# EAGLE schematic Environment-ArduinoNano44-Mini-Enclosure-V10 (EAGLE 7.4.0)
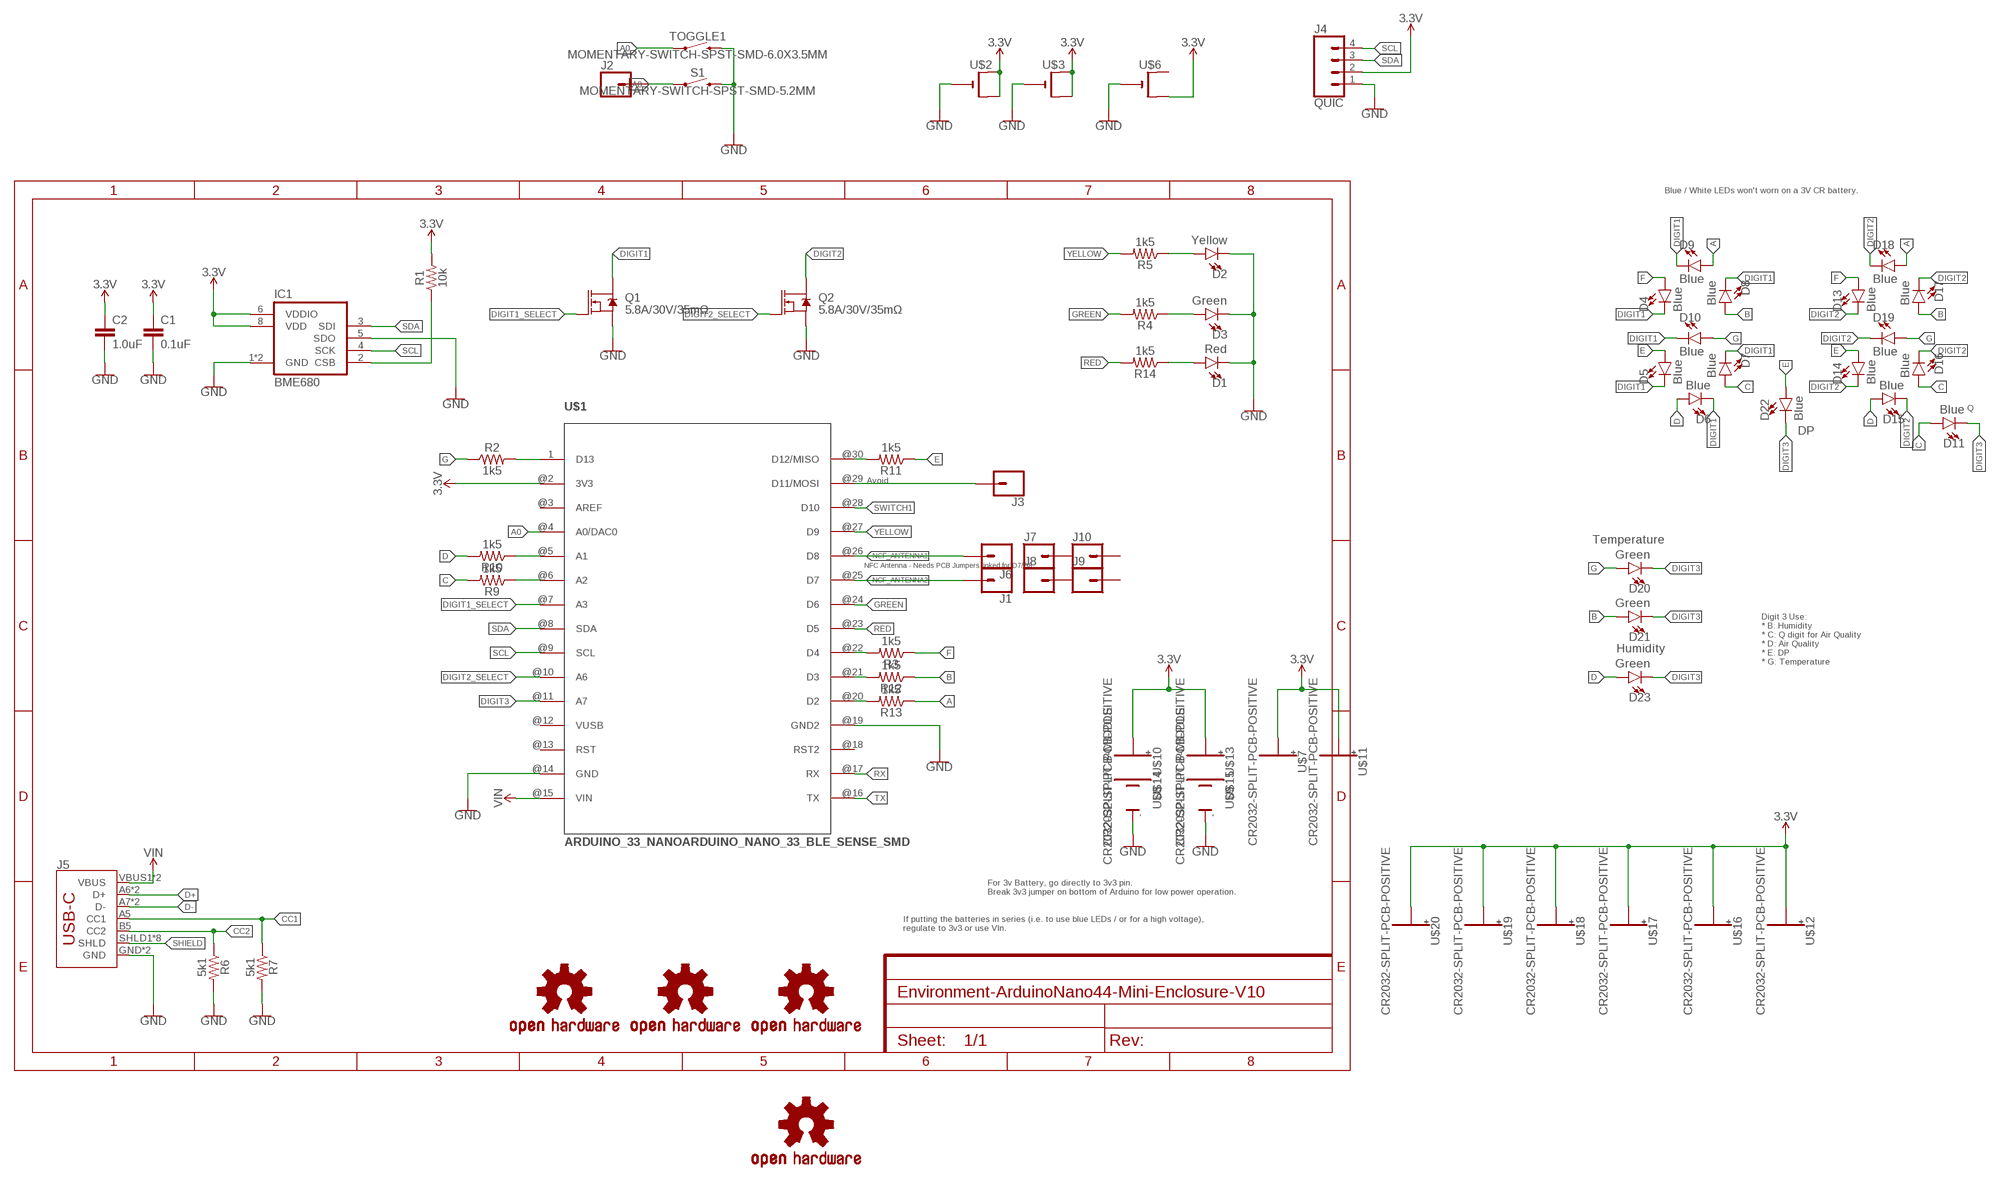
[diagram p0: schematic, sheet 1]

## Parts
C1  0.1uF  0.1UF-0805-25V  [0805]
C2  1.0uF  1.0UF-0805-25V-10%  [0805]
D1  Red  LED1206  [LED-1206]
D2  Yellow  LED1206  [LED-1206]
D3  Green  LED1206  [LED-1206]
D4  Blue  LED1206  [LED-1206]
D5  Blue  LED1206  [LED-1206]
D6  Blue  LED1206  [LED-1206]
D7  Blue  LED1206  [LED-1206]
D8  Blue  LED1206  [LED-1206]
D9  Blue  LED1206  [LED-1206]
D10  Blue  LED1206  [LED-1206]
D11  Blue  LED1206  [LED-1206]
D13  Blue  LED1206  [LED-1206]
D14  Blue  LED1206  [LED-1206]
D15  Blue  LED1206  [LED-1206]
D16  Blue  LED1206  [LED-1206]
D17  Blue  LED1206  [LED-1206]
D18  Blue  LED1206  [LED-1206]
D19  Blue  LED1206  [LED-1206]
D20  Green  LED1206  [LED-1206]
D21  Green  LED1206  [LED-1206]
D22  Blue  LED1206  [LED-1206]
D23  Green  LED1206  [LED-1206]
IC1  BME680  [BME680]
J1  CONN_01  [1X01]
J2  CONN_01  [1X01]
J3  CONN_01  [1X01]
J4  QUIC  CONN_04SMD2  [JST04_1MM_RA]
J5  USB_C2-LAYER  [USB-C-16P]
J6  CONN_01  [1X01]
J7  CONN_01  [1X01]
J8  CONN_01  [1X01]
J9  CONN_01  [1X01]
J10  CONN_01  [1X01]
LOGO1  OSHW-LOGOM  [OSHW-LOGO-M]
LOGO2  OSHW-LOGOL  [OSHW-LOGO-L]
LOGO3  OSHW-LOGOL  [OSHW-LOGO-L]
LOGO7  OSHW-LOGOM  [OSHW-LOGO-M]
Q1  5.8A/30V/35mΩ  MOSFET-NCH-AO3404A  [SOT23-3]
Q2  5.8A/30V/35mΩ  MOSFET-NCH-AO3404A  [SOT23-3]
R1  10k  RESISTOR0805  [0805]
R2  1k5  RESISTOR0805  [0805]
R3  1k5  RESISTOR0805  [0805]
R4  1k5  RESISTOR0805  [0805]
R5  1k5  RESISTOR0805  [0805]
R6  5k1  RESISTOR0805  [0805]
R7  5k1  RESISTOR0805  [0805]
R9  1k5  RESISTOR0805  [0805]
R10  1k5  RESISTOR0805  [0805]
R11  1k5  RESISTOR0805  [0805]
R12  1k5  RESISTOR0805  [0805]
R13  1k5  RESISTOR0805  [0805]
R14  1k5  RESISTOR0805  [0805]
S1  MOMENTARY-SWITCH-SPST-SMD-5.2MM  [TACTILE_SWITCH_SMD_5.2MM]
TOGGLE1  MOMENTARY-SWITCH-SPST-SMD-6.0X3.5MM  [TACTILE_SWITCH_SMD_6.0X3.5MM]
U$1  ARDUINO_33_NANOARDUINO_NANO_33_BLE_SENSE_SMD  [ARDUINO_NANO_33_SMD]
U$2  CR2032SMT  [CR2032-SMD]
U$3  CR2032SMT  [CR2032-SMD]
U$6  CR2032SMT  [CR2032-SMD]
U$7  CR2032-SPLIT-PCB-POSITIVE  [CR2032-SMD-POSITIVE-TERMINAL]
U$8  CR2032-SPLIT-PCBCR2032-NEGATIVE  [CR2032-SMD-NEGATIVE-TERMINAL]
U$9  CR2032-SPLIT-PCBCR2032-NEGATIVE  [CR2032-SMD-NEGATIVE-TERMINAL]
U$10  CR2032-SPLIT-PCB-POSITIVE  [CR2032-SMD-POSITIVE-TERMINAL]
U$11  CR2032-SPLIT-PCB-POSITIVE  [CR2032-SMD-POSITIVE-TERMINAL]
U$12  CR2032-SPLIT-PCB-POSITIVE  [CR2032-SMD-POSITIVE-TERMINAL]
U$13  CR2032-SPLIT-PCB-POSITIVE  [CR2032-SMD-POSITIVE-TERMINAL]
U$14  CR2032-SPLIT-PCB-MIDDLE  [CR2032-SMD-MIDDLE-OUTLINE]
U$15  CR2032-SPLIT-PCB-MIDDLE  [CR2032-SMD-MIDDLE-OUTLINE]
U$16  CR2032-SPLIT-PCB-POSITIVE  [CR2032-SMD-POSITIVE-TERMINAL]
U$17  CR2032-SPLIT-PCB-POSITIVE  [CR2032-SMD-POSITIVE-TERMINAL]
U$18  CR2032-SPLIT-PCB-POSITIVE  [CR2032-SMD-POSITIVE-TERMINAL]
U$19  CR2032-SPLIT-PCB-POSITIVE  [CR2032-SMD-POSITIVE-TERMINAL]
U$20  CR2032-SPLIT-PCB-POSITIVE  [CR2032-SMD-POSITIVE-TERMINAL]

## Nets
3.3V: C1.1 C2.1 IC1.6(VDDIO) IC1.8(VDD) J4.2 R1.2 U$1.@2(3V3) U$2.+$1(+) U$2.+$2(+1) U$3.+$1(+) U$3.+$2(+1) U$6.+$2(+1) U$7.+ U$10.+ U$11.+ U$12.+ U$13.+ U$16.+ U$17.+ U$18.+ U$19.+ U$20.+
A: D9.A D18.A R13.1
A0: J2.1 S1.1 TOGGLE1.1 U$1.@4(A0/DAC0)
B: D8.A D17.A D21.A R12.1
C: D7.A D11.A D16.A R9.2
CC1: J5.A5(CC1) R7.1
CC2: J5.B5(CC2) R6.1
D: D6.A D15.A D23.A R10.2
D+: J5.A6(D+) J5.B6(D+)
D-: J5.A7(D-) J5.B7(D-)
DIGIT1: D4.C D5.C D6.C D7.C D8.C D9.C D10.C Q1.3(D)
DIGIT1_SELECT: Q1.1(G) U$1.@7(A3)
DIGIT2: D13.C D14.C D15.C D16.C D17.C D18.C D19.C Q2.3(D)
DIGIT2_SELECT: Q2.1(G) U$1.@10(A6)
DIGIT3: D11.C D20.C D21.C D22.C D23.C U$1.@11(A7)
E: D5.A D14.A D22.A R11.1
F: D4.A D13.A R3.1
G: D10.A D19.A D20.A R2.1
GND: C1.2 C2.2 D1.C D2.C D3.C IC1.1(GND) IC1.5(SDO) IC1.7(GND) J4.1 J5.GND J5.GND2(GND) Q1.2(S) Q2.2(S) R6.2 R7.2 S1.3 TOGGLE1.2 U$1.@14(GND) U$1.@19(GND2) U$2.- U$3.- U$6.- U$8.- U$9.-
GREEN: R4.2 U$1.@24(D6)
N$2: IC1.2(CSB) R1.1
N$4: D1.A R14.1
N$7: R9.1 U$1.@6(A2)
N$8: R2.2 U$1.1(D13)
N$9: R11.2 U$1.@30(D12/MISO)
N$10: R12.2 U$1.@21(D3)
N$11: R10.1 U$1.@5(A1)
N$12: R13.2 U$1.@20(D2)
N$13: R3.2 U$1.@22(D4)
N$14: D3.A R4.1
N$16: D2.A R5.1
N$43: J3.1 U$1.@29(D11/MOSI)
NCF_ANTENNA1: J6.1 U$1.@26(D8)
NCF_ANTENNA2: J1.1 U$1.@25(D7)
RED: R14.2 U$1.@23(D5)
RX: U$1.@17(RX)
SCL: IC1.4(SCK) J4.4 U$1.@9(SCL)
SDA: IC1.3(SDI) J4.3 U$1.@8(SDA)
SHIELD: J5.SHLD1(SHLD) J5.SHLD2(SHLD) J5.SHLD3(SHLD) J5.SHLD4(SHLD) J5.SHLD5(SHLD) J5.SHLD6(SHLD) J5.SHLD7(SHLD) J5.SHLD8(SHLD)
SWITCH1: U$1.@28(D10)
TX: U$1.@16(TX)
VIN: J5.VBUS1(VBUS) J5.VBUS2(VBUS) U$1.@15(VIN)
YELLOW: R5.2 U$1.@27(D9)
Unconnected: J7.1 J8.1 J9.1 J10.1 U$1.@3(AREF) U$1.@13(RST) U$1.@18(RST2) U$6.+$1(+)

## Notes on the sheet
- Blue / White LEDs won't worn on a 3V CR battery.
- Q
- DP
- Avoid
- Temperature
- NFC Antenna - Needs PCB Jumpers linked for D7/D8
- Humidity
- Digit 3 Use:
  * B: Humidity
  * C: Q digit for Air Quality
  * D: Air Quality
  * E: DP
  * G: Temperature
- For 3v Battery, go directly to 3v3 pin.
  Break 3v3 jumper on bottom of Arduino for low power operation.
- If putting the batteries in series (i.e. to use blue LEDs / or for a high voltage), 
  regulate to 3v3 or use VIn.

## Power pins joined to a net without a drawn wire
VUSB: U$1.@12(VUSB)

## Library data of the parts
C1 = ThingySticks:0.1UF: 0.1µF ceramic capacitors A capacitor is a passive two-terminal electrical component used to store electrical energy temporarily in an electric field.
C2 = ThingySticks:1.0UF: 1µF ceramic capacitors A capacitor is a passive two-terminal electrical component used to store electrical energy temporarily in an electric field.
D1-D11 D13-D23 = ThingySticks:LED: LED (Generic) Standard schematic elements and footprints for 5mm, 3mm, 1206, and 0603 sized LEDs. Generic LEDs with no color specified.
IC1 = ThingySticks:BME680: BME680 integrates for the first time individual high linearity and high accuracy sensors for gas, pressure, humidity and temperature. The library has been designed by Richard Magdycz <https://www.facebook.com/groups/eaglecadsoftUK> Original version had pins in incorrect places (BME680 uses untypical clockwise direction). Updated 17 Feb 2018 S.Harrison ThingySticks.com
J1-J3 J6-J10 = SparkFun-Connectors:CONN_01: Single connection point. Often used as Generic Header-pin footprint for 0.1 inch spaced/style header connections On any of the 0.1 inch spaced packages, you can populate with these: Break Away Headers - Straight <https://www.sparkfun.com/products/116> (PRT-00116) Break Away Male Headers - Right Angle <https://www.sparkfun.com/products/553> (PRT-00553) Female Headers <https://www.sparkfun.com/products/115> (PRT-00115) Break Away Headers - Machine Pin <https://www.sparkfun.com/products/117> (PRT-00117) Break Away Female Headers - Swiss Machine Pin <https://www.sparkfun.com/products/743> (PRT-00743) This device is also useful as a general connection point to wire up your design to another part of your project. Our various solder wires solder well into these plated through hole pads. Hook-Up Wire - Assortment (Stranded, 22 AWG) <https://www.sparkfun.com/products/11375> (PRT-11375) Hook-Up Wire - Assortment (Solid Core, 22 AWG) <https://www.sparkfun.com/products/11367> (PRT-11367) View the entire wire category on our website here <https://www.sparkfun.com/categories/141> Special notes: SMTSO-256-ET is a "flush mount" nut for a 4-40 screw. We mostly use this on specialty testbeds; it is a nice way to connect hardware to your PCB at an adjustable hieght. Also note, the SNAP packages are for using a snappable style connector. We sell a baggie of snaps and they are also used on two LilyPad designs: Snap Assortment - 30 pack (male and female) <https://www.sparkfun.com/products/11347> (DEV-11347) LilyPad Arduino SimpleSnap <https://www.sparkfun.com/products/10941> (DEV-10941) LilyPad SimpleSnap Protoboard <https://www.sparkfun.com/products/10940> (DEV-10940)
J4 = SparkFun-Connectors-2020-01-17:CONN_04: Multi connection point. Often used as Generic Header-pin footprint for 0.1 inch spaced/style header connections On any of the 0.1 inch spaced packages, you can populate with these: Break Away Headers - Straight <https://www.sparkfun.com/products/116> (PRT-00116) Break Away Male Headers - Right Angle <https://www.sparkfun.com/products/553> (PRT-00553) Female Headers <https://www.sparkfun.com/products/115> (PRT-00115) Break Away Headers - Machine Pin <https://www.sparkfun.com/products/117> (PRT-00117) Break Away Female Headers - Swiss Machine Pin <https://www.sparkfun.com/products/743> (PRT-00743) For SCREWTERMINALS and SPRING TERMINALS visit here: Screw Terimnals on SparkFun.com <https://www.sparkfun.com/search/results?term=Screw+Terminals> (5mm/3.5mm/2.54mm spacing) This device is also useful as a general connection point to wire up your design to another part of your project. Our various solder wires solder well into these plated through hole pads. Hook-Up Wire - Assortment (Stranded, 22 AWG) <https://www.sparkfun.com/products/11375> (PRT-11375) Hook-Up Wire - Assortment (Solid Core, 22 AWG) <https://www.sparkfun.com/products/11367> (PRT-11367) View the entire wire category on our website here <https://www.sparkfun.com/categories/141> Special notes: Molex polarized connector foot print use with SKU : PRT-08231 with associated crimp pins and housings. 1MM SMD Version SKU: PRT-10208; PROD_ID: CONN-10310; SF_ID: PRT-10208
J5 = SparkFun-Connectors-2020-01-17:USB_C: USB Type C 16Pin Connector Super Speed pins not available on the 16-pin purely SMD connector so this part is best for USB 2.0 implementations. D1 and D2 are tied together enabling D+/- no matter which way the cable is plugged into the connector. The two channel configuration pins (CC1/2) are exposed. These are normally connected to ground via 5.1k resistors but can be reconfigured for high current/high power applications.; PROD_ID: CONN-14122
LOGO1-LOGO3 LOGO7 = SparkFun-Aesthetics:OSHW-LOGO: Open-Source Hardware (OSHW) Logo This logo indicates the piece of hardware it is found on incorporates a OSHW license and/or adheres to the definition of open source hardware found here: http://freedomdefined.org/OSHW
Q1 Q2 = SparkFun-DiscreteSemi:MOSFET-NCH: N-channel MOSFETs Voltage controlled devices that allow control of high current outputs. SparkFun Products: SparkFun OpenScale <https://www.sparkfun.com/products/13261> SparkFun Digital Sandbox <https://www.sparkfun.com/products/12651> SparkFun Monster Moto Shield <https://www.sparkfun.com/products/10182> SparkFun MOSFET Power Controller <https://www.sparkfun.com/products/11214>; PROD_ID: TRANS-12988
R1-R7 R9-R14 = SparkFun-Resistors:RESISTOR: Generic Resistor Package
S1 = ThingySticks:MOMENTARY-SWITCH-SPST: Momentary Switch (Pushbutton) - SPST Normally-open (NO) SPST momentary switches (buttons, pushbuttons). Variants PTH-12MM - 12mm square, through-hole Momentary Pushbutton Switch - 12mm Square <https://www.sparkfun.com/products/9190> (COM-09190) PTH-6.0MM, PTH-6.0MM-KIT - 6.0mm square, through-hole Mini Pushbutton Switch <https://www.sparkfun.com/products/97> (COM-00097) KIT package intended for soldering kit's - only one side of pads' copper is exposed. PTH-RIGHT-ANGLE-KIT - Right-angle, through-hole Right Angle Tactile Button <https://www.sparkfun.com/products/10791> - Used on SparkFun BigTime Watch Kit <https://www.sparkfun.com/products/11734> SMD-12MM - 12mm square, surface-mount Tactile Button - SMD (12mm) <https://www.sparkfun.com/products/12993> (COM-12993) Used on SparkFun PicoBoard <https://www.sparkfun.com/products/11888> SMD-4.5MM - 4.5mm Square Trackball Switch Used on SparkFun Blackberry Trackballer Breakout <https://www.sparkfun.com/products/13169> SMD-4.6MMX2.8MM - 4.60mm x 2.80mm, surface mount Used on SparkFun SAMD21 Mini Breakout <https://www.sparkfun.com/products/13664> SMD-5.2MM, SMD-5.2-REDUNDANT - 5.2mm square, surface-mount Mini Pushbutton Switch - SMD <https://www.sparkfun.com/products/8720> (COM-08720) Used on Arduino Pro Mini <https://www.sparkfun.com/products/11114> REDUNDANT package connects both switch circuits together SMD-6.0X3.5MM - 6.0 x 3.5mm, surface mount Momentary Reset Switch SMD <https://www.sparkfun.com/products/8229> (COM-08229) SMD-6.2MM-TALL - 6.2mm square, surface mount Tactile Button - SMD (6mm) <https://www.sparkfun.com/products/12992> Used on SparkFun Digital Sandbox <https://www.sparkfun.com/products/12651> SMD-RIGHT-ANGLE - Right-angle, surface mount Used on SparkFun Block for Intel® Edison - Arduino <https://www.sparkfun.com/products/13036>; PROD_ID: SWCH-08247; SF_SKU: COM-08720
TOGGLE1 = ThingySticks:MOMENTARY-SWITCH-SPST: Momentary Switch (Pushbutton) - SPST Normally-open (NO) SPST momentary switches (buttons, pushbuttons). Variants PTH-12MM - 12mm square, through-hole Momentary Pushbutton Switch - 12mm Square <https://www.sparkfun.com/products/9190> (COM-09190) PTH-6.0MM, PTH-6.0MM-KIT - 6.0mm square, through-hole Mini Pushbutton Switch <https://www.sparkfun.com/products/97> (COM-00097) KIT package intended for soldering kit's - only one side of pads' copper is exposed. PTH-RIGHT-ANGLE-KIT - Right-angle, through-hole Right Angle Tactile Button <https://www.sparkfun.com/products/10791> - Used on SparkFun BigTime Watch Kit <https://www.sparkfun.com/products/11734> SMD-12MM - 12mm square, surface-mount Tactile Button - SMD (12mm) <https://www.sparkfun.com/products/12993> (COM-12993) Used on SparkFun PicoBoard <https://www.sparkfun.com/products/11888> SMD-4.5MM - 4.5mm Square Trackball Switch Used on SparkFun Blackberry Trackballer Breakout <https://www.sparkfun.com/products/13169> SMD-4.6MMX2.8MM - 4.60mm x 2.80mm, surface mount Used on SparkFun SAMD21 Mini Breakout <https://www.sparkfun.com/products/13664> SMD-5.2MM, SMD-5.2-REDUNDANT - 5.2mm square, surface-mount Mini Pushbutton Switch - SMD <https://www.sparkfun.com/products/8720> (COM-08720) Used on Arduino Pro Mini <https://www.sparkfun.com/products/11114> REDUNDANT package connects both switch circuits together SMD-6.0X3.5MM - 6.0 x 3.5mm, surface mount Momentary Reset Switch SMD <https://www.sparkfun.com/products/8229> (COM-08229) SMD-6.2MM-TALL - 6.2mm square, surface mount Tactile Button - SMD (6mm) <https://www.sparkfun.com/products/12992> Used on SparkFun Digital Sandbox <https://www.sparkfun.com/products/12651> SMD-RIGHT-ANGLE - Right-angle, surface mount Used on SparkFun Block for Intel® Edison - Arduino <https://www.sparkfun.com/products/13036>; PROD_ID: SWCH-00815; SF_SKU: COM-08229
U$1 = ThingySticks:ARDUINO_33_NANO: https://store.arduino.cc/nano-33-iot
U$2 U$3 U$6 = ThingySticks:CR2032
U$7 U$10-U$13 U$16-U$20 = ThingySticks:CR2032-SPLIT-PCB-POSITIVE
U$8 U$9 = ThingySticks:CR2032-SPLIT-PCB
U$14 U$15 = ThingySticks:CR2032-SPLIT-PCB-MIDDLE